# EAGLE design main (EAGLE 7.2.0)
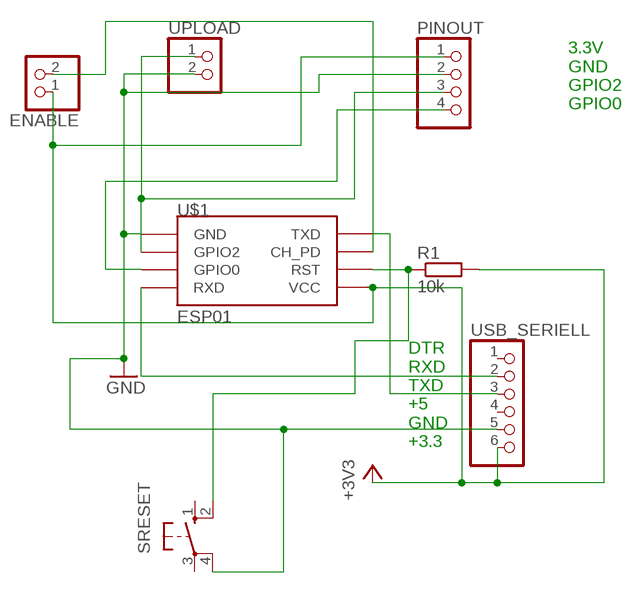
[diagram p0: schematic, sheet 1]

## Parts
ENABLE  PINHD-1X2  [1X02]
PINOUT  PINHD-1X4  [1X04]
R1  10k  R-EU_0207/10  [0207/10]
SRESET  10-XX  [B3F-10XX]
U$1  ESP01  [ESP01]
UPLOAD  PINHD-1X2  [1X02]
USB_SERIELL  PINHD-1X6  [1X06]

## Nets
+3V3: ENABLE.1 PINOUT.1 R1.2 U$1.VCC USB_SERIELL.6
GND: PINOUT.2 SRESET.4(P1) U$1.GND UPLOAD.2 USB_SERIELL.5
N$1: U$1.RX(RXD) USB_SERIELL.2
N$2: U$1.TX(TXD) USB_SERIELL.3
N$4: PINOUT.3 U$1.GPIO2 UPLOAD.1
N$5: PINOUT.4 U$1.GPIO0
N$6: R1.1 SRESET.2(S1) U$1.RST
N$10: ENABLE.2 U$1.CH_PD
Unconnected: SRESET.1(S) SRESET.3(P) USB_SERIELL.1 USB_SERIELL.4

## Notes on the sheet
- 3.3V
  GND
  GPIO2
  GPIO0
- DTR
  RXD
  TXD
  +5
  GND
  +3.3

## Library data of the parts
ENABLE UPLOAD = pinhead:PINHD-1X2: PIN HEADER
PINOUT = pinhead:PINHD-1X4: PIN HEADER
R1 = resistor:R-EU_: RESISTOR, European symbol
SRESET = switch-omron:10-XX: OMRON SWITCH; MPN: B3F-1000; OC_FARNELL: 176432; OC_NEWARK: 36M3542
U$1 = esp8266modules:ESP01: ESP8266 Wifi module 01
USB_SERIELL = pinhead:PINHD-1X6: PIN HEADER

## Board
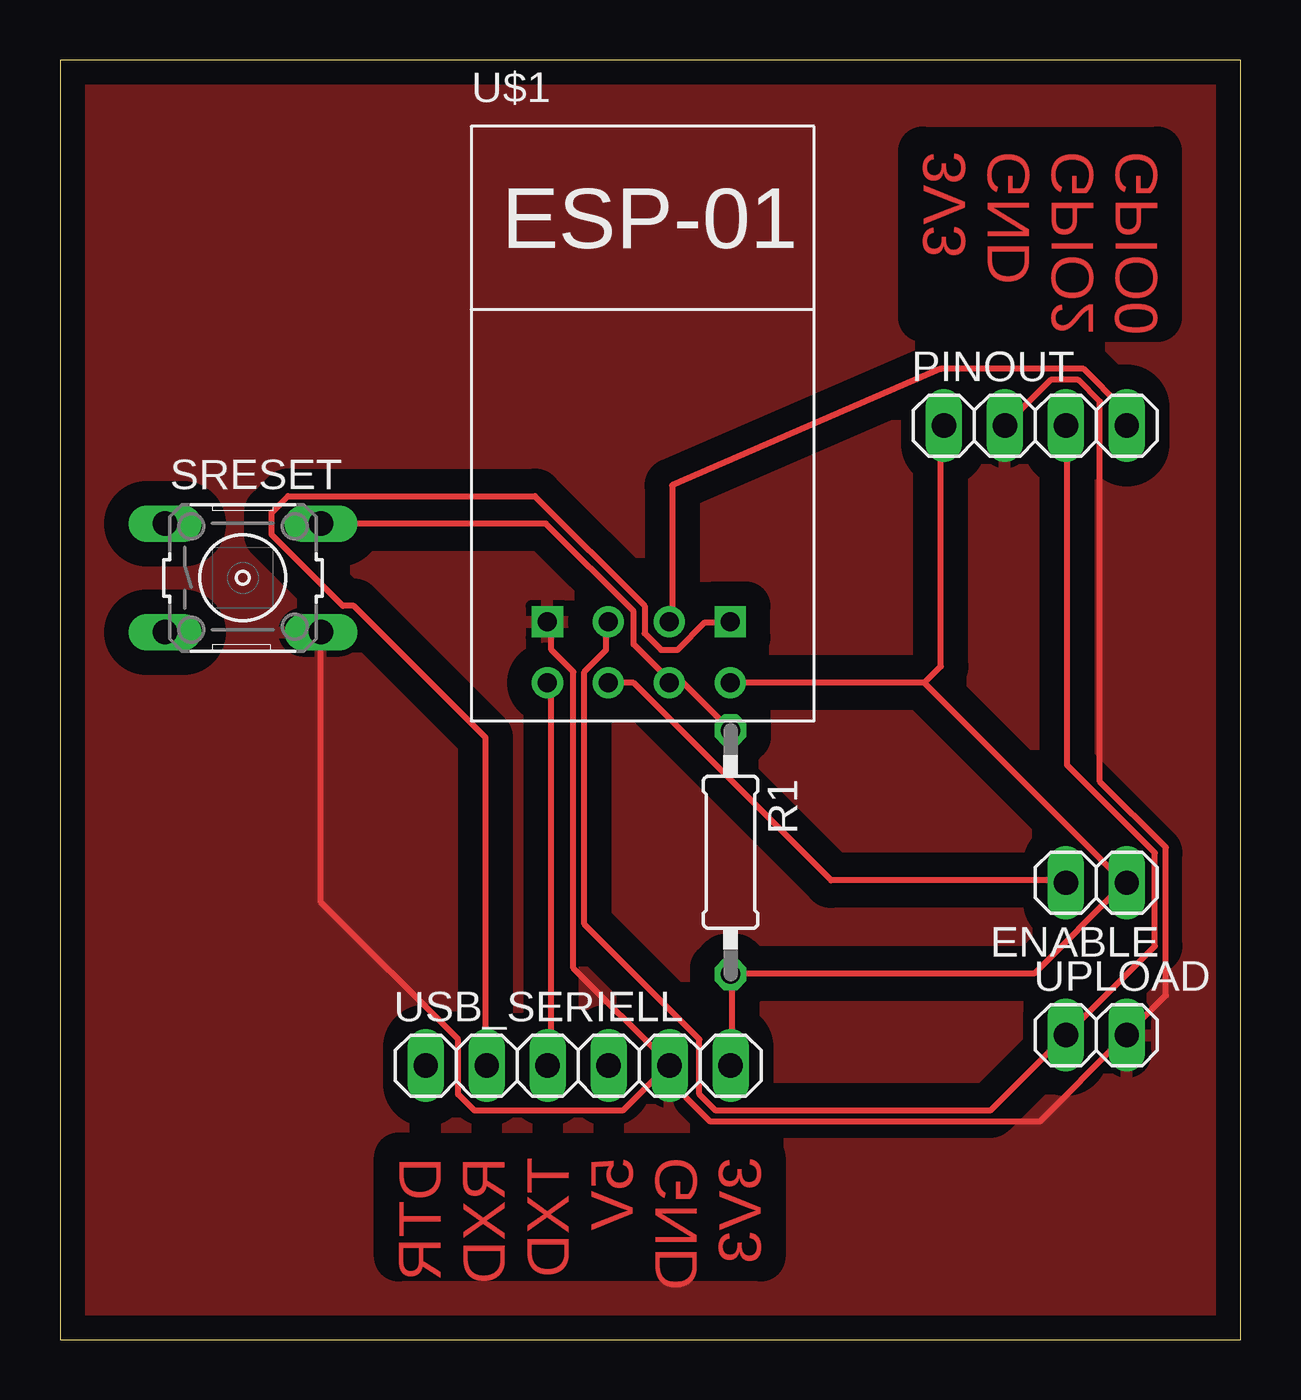
[diagram p1: board, top side]

Size 49.2 x 53.33 mm. Coordinates in mm from the lower left corner, seen from the top.
Outline: 0,0 49.2,0 49.2,53.33 0,53.33 0,0
Copper layers (1*16): Top 0.035mm / dielectric 1.5mm / Bottom 0.035mm
Design rules "default": minimum track width 10mil, minimum drill 24mil, track to track 8mil, track to pad 8mil, pad to pad 8mil, via to via 8mil, smd to smd 8mil, copper to edge 40mil, drill to drill 8mil, minimum pad ring 10mil, minimum via ring 8mil, stop-mask expansion 4mil, vias tented up to drill 0mil, thermal gap 10mil

### Footprints (pad centres in the part's own frame; a part is rotated, then mirrored left to right if it is on the bottom)
1X02 = drill 1.016 long: 1 -1.27,0; 2 1.27,0
1X04 = drill 1.016 long: 1 -3.81,0; 2 -1.27,0; 3 1.27,0; 4 3.81,0
0207/10 = drill 0.813 octagon: 1 -5.08,0; 2 5.08,0
B3F-10XX = drill 1.016 long: 1 -3.251,2.261; 2 3.251,2.261; 3 -3.251,-2.261; 4 3.251,-2.261
ESP01 = drill 0.8: CH_PD -1.285,-8.178; GPIO0 1.255,-5.638; GPIO2 -1.285,-5.638; RST 1.255,-8.178; TX -3.825,-8.178; VCC 3.795,-8.178 | drill 0.8 square: GND -3.825,-5.638; RX 3.795,-5.638
1X06 = drill 1.016 long: 1 -6.35,0; 2 -3.81,0; 3 -1.27,0; 4 1.27,0; 5 3.81,0; 6 6.35,0

### Placement (x,y rotation side)
ENABLE  43.18,19.05 180 top
PINOUT  40.64,38.1 0 top
R1  27.94,20.32 270 top
SRESET  7.62,31.75 0 top
U$1  24.13,35.56 0 top
UPLOAD  43.18,12.7 0 top
USB_SERIELL  21.59,11.43 0 top

### Tracks (layer width: path | path; a pad name or v marks a point on that pad's centre or on a via)
+3V3
  Top 0.254: USB_SERIELL.6 28.02,11.61 28.02,15.04 R1.2 28.02,15.27 40.59,15.27 44.25,18.92 ENABLE.1 44.25,19.15 36.02,27.38 | 36.02,27.38 28.02,27.38 U$1.VCC | 36.02,27.38 36.7,28.07 36.7,37.95 PINOUT.1
GND
  Top 0.254: U$1.GND 20.47,29.9 20.47,28.75 21.39,27.84 21.39,15.49 25.27,11.61 USB_SERIELL.5 | SRESET.4 10.87,18.24 16.59,12.52 16.59,10.24 17.27,9.55 23.44,9.55 25.04,11.15 | 25.04,11.15 25.27,11.38 USB_SERIELL.5 | PINOUT.2 41.27,40.01 42.42,40.01 43.33,39.09 43.33,23.27 46.08,20.52 46.08,14.35 44.48,12.75 UPLOAD.2 44.25,12.52 40.82,9.09 27.1,9.09 25.04,11.15 | 25.04,11.15 USB_SERIELL.5
  pour Top (isolate 1.016): 0,53.34 49.53,53.34 49.53,0 0,0
N$1
  Top 0.254: U$1.RX 27.79,29.9 26.87,29.9 25.73,28.75 25.04,28.75 24.36,29.44 24.36,30.58 19.79,35.15 9.5,35.15 8.81,34.47 8.81,33.55 11.79,30.58 12.24,30.58 17.73,25.09 17.73,11.61 USB_SERIELL.2
N$2
  Top 0.254: U$1.TX 20.47,27.38 20.47,11.61 USB_SERIELL.3
N$4
  Top 0.254: U$1.GPIO2 22.76,29.9 22.76,28.75 21.84,27.84 21.84,17.32 26.64,12.52 26.64,10.24 27.33,9.55 38.76,9.55 UPLOAD.1 45.62,16.41 45.62,20.3 41.96,23.95 41.96,37.95 PINOUT.3
N$5
  Top 0.254: U$1.GPIO0 25.5,30.12 25.5,35.61 36.7,40.46 42.65,40.46 44.25,38.86 44.25,38.18 PINOUT.4
N$6
  Top 0.254: R1.1 25.96,27.38 25.5,27.38 U$1.RST 25.27,27.61 23.9,28.98 23.9,30.35 20.24,34.01 SRESET.2
N$10
  Top 0.254: U$1.CH_PD 22.99,27.38 23.9,27.38 32.13,19.15 41.73,19.15 ENABLE.2

### Text on the board
Top: 3V3 / GND / GPIO2 / GPIO0 | DTR / RXD / TXD / 5V / GND / 3V3